# Altium schematic sheet 5V_To_3_3V.SchDoc
size A
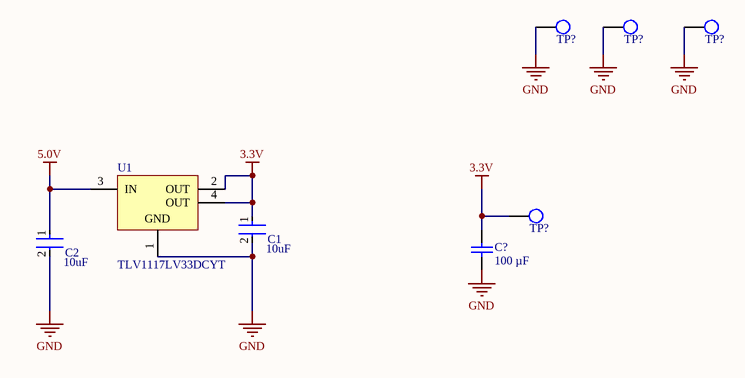
[diagram p0: 5V_To_3_3V.SchDoc]

## Parts
(Parts that share a designator on the sheet are numbered #1, #2 ... from top to bottom, then left to right.)
C1  Capacitance: 10uF  [FP-CL21-IPC_B]  (hidden comment: CL21A106KQCLNNC)
C2  Capacitance: 10uF  [FP-CL21-IPC_B]  (hidden comment: CL21A106KQCLNNC)
C?  Capacitance: 100 µF  [CAP_EEEHA1A101WP]  (hidden comment: EEEHA1A101WP)
TP?#1  TP_1206  [TP-SMC-1206]  (value not drawn)
TP?#2  TP_1206  [TP-SMC-1206]  (value not drawn)
TP?#3  TP_1206  [TP-SMC-1206]  (value not drawn)
TP?#4  TP_1206  [TP-SMC-1206]  (value not drawn)
U1  TLV1117LV33DCYT  [DCY0004A_M]

## Nets
3.3V: C1.1 C?.2 TP?#4.1 U1.2(OUT) U1.4(OUT)
5.0V: C2.1 U1.3(IN)
GND: C1.2 C2.2 C?.1 TP?#1.1 TP?#2.1 TP?#3.1 U1.1(GND)

## Library data of the parts
C1 C2 = CMP-13271-003047-1: CL21 Series 0805 10uF 6.3V ±10% Tolerance X5R Multilayer Ceramic Chip Capacitor; Lead Free: Lead Free; Mount: Surface Mount; Case/Package: 0805; Packaging: Tape and Reel; Max Operating Temperature: 85°C; Min Operating Temperature: -55°C; Voltage Rating: 6.3V; Case Code (Metric): 2012; Radiation Hardening: No; Tolerance: 10%; Package Quantity: 1; Depth: 1.25mm; Width: 0.049inch; Dielectric: X5R; Height: 0.85mm; Case Code (Imperial): 0805; Length: 2mm; Thickness: 0.037inch
C? = EEEHA1A101WP: 100ÂµF 10V Aluminum Electrolytic Capacitors Radial, Can - SMD 1000 Hrs @ 105Â°C; MF: Panasonic; MP: EEE-HA1A101WP; SnapEDA_Link: https://www.snapeda.com/parts/EEE-HA1A101WP/Panasonic/view-part/?ref=snap; Price: None; Package: RADIAL-2 Panasonic; Value: *; Check_prices: https://www.snapeda.com/parts/EEE-HA1A101WP/Panasonic/view-part/?ref=eda; Purchase-URL: https://pricing.snapeda.com/search/part/EEE-HA1A101WP/?ref=eda; Availability: In Stock
TP?#1-TP?#4 = TP_1206: Test Point SMD 1206; Manufacturer: TE Connectivity (Tyco Electronics); Manufacturer Part Number: 1625854-1; Resistance Value: 0 Ohm; Temperature Coefficient: N/R; Supplier: Digi-Key; Stock 1: 31937; Pricing 1: 1=0.28, 10=0.261, 25=0.224, 50=0.1902, 100=0.1828, 250=0.1641, 500=0.1567, 1000=0.1306 (USD); Case Size: 1206; Dimension: 3.2 x 1.6 x 1.25mm; Family: RC; Mounting: Surface Mount; Operating Temperature: -55 to 125 C; Part No: 1625854-1; RoHS: Yes; Packaging: Tape and Reel; Termination Style: N/R; Terminal Pitch: N/R; Power Rating: N/R; Tolerance: N/R; ComponentLink1URL: https://datasheet.ciiva.com/6439/eng-ds-1773266-a-6439169.pdf; ComponentLink1Description: https://datasheet.ciiva.com/6439/eng-ds-1773266-a-6439169.pdf; ComponentLink2URL: https://datasheet.ciiva.com/30136/1773266-a-30136341.pdf; ComponentLink2Description: https://datasheet.ciiva.com/30136/1773266-a-30136341.pdf; ComponentLink3URL: https://datasheet.ciiva.com/6439/eng-ds-1773266-a-6439080.pdf; ComponentLink3Description: https://datasheet.ciiva.com/6439/eng-ds-1773266-a-6439080.pdf; ComponentLink4URL: https://datasheet.ciiva.com/6439/eng-ds-1773266-a-6439081.pdf; ComponentLink4Description: https://datasheet.ciiva.com/6439/eng-ds-1773266-a-6439081.pdf; ComponentLink5URL: https://datasheet.ciiva.com/6439/eng-ds-1773266-a-6439083.pdf; ComponentLink5Description: https://datasheet.ciiva.com/6439/eng-ds-1773266-a-6439083.pdf; Supplier Part Number: A106143CT-ND
U1 = CMP-0395-00499-2: Single Output LDO, 1 A, Fixed 3.3 V Output, 2 to 5.5 V Input, 4-pin SOT-223 (DCY), -40 to 125 degC, Green (RoHS & no Sb/Br); Manufacturer: Texas Instruments; Vout Adj(Max)(V): 3.3; Iout(Max)(A): 1; SubFamily: Single Channel LDO; Iq(Typ)(mA): 0.05; Accuracy(%): 2; Vin(Max)(V): 5.5; Vdo(Typ)(mV): 1200; PartNumber: TLV1117LV33DCYT; PackageReference: DCY0004A; PackageVersion: 4202506/B; ComponentLink1URL: http://www.ti.com/; DatasheetVersion: SBVS160A; Mounting Technology: Surface Mount; Fixed Output Options(V): 3.3; ComponentLink3Description: Package Specification; PackageDescription: 4-Pin Plastic Small Outline, Body 3.5 x 6.5 mm, Pitch 2.3 mm; Vout Adj(Min)(V): 3.3; ComponentLink2URL: http://www.ti.com/general/docs/lit/getliterature.tsp?genericPartNumber=TLV1117LV33&fileType=pdf; Code_JEDEC: TO-261; ComponentLink1Description: Manufacturer URL; Vin(Min)(V): 2; ComponentLink2Description: Datasheet; Eco-Plan: Green (RoHS & no Sb/Br); ComponentLink3URL: http://www.ti.com/litv/pdf/mpds094a